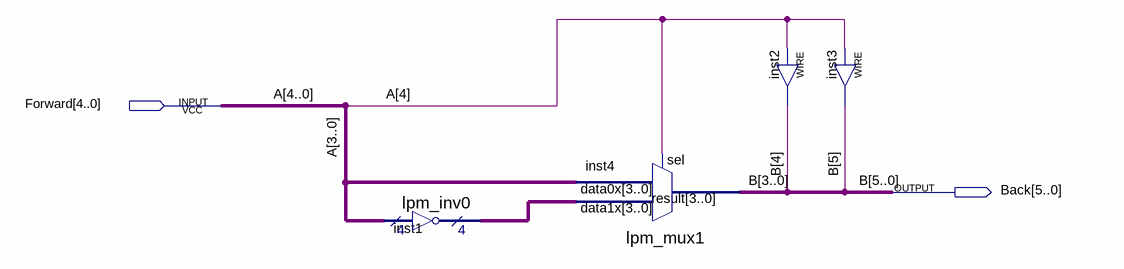
[diagram p0: schematic sheet]
// Quartus schematic F5toB6.bdf as structural Verilog: 4 symbols, 2 pins
module F5toB6 (
  input  [4:0] Forward,
  output [5:0] Back
);

  wire [3:0] inst1_result;

  lpm_inv0 inst1 (.data(Forward[3:0]), .result(inst1_result));
  lpm_mux1 inst4 (.data1x(inst1_result), .data0x(Forward[3:0]), .sel(Forward[4]), .result(Back[3:0]));
  assign Back[4] = Forward[4];  // WIRE inst2
  assign Back[5] = Forward[4];  // WIRE inst3

  // Other names for the same wires on the sheet: A[4:0] = Forward; B[5:0] = Back
endmodule
